# Altium schematic sheet CUBE3RX.SchDoc
size A3
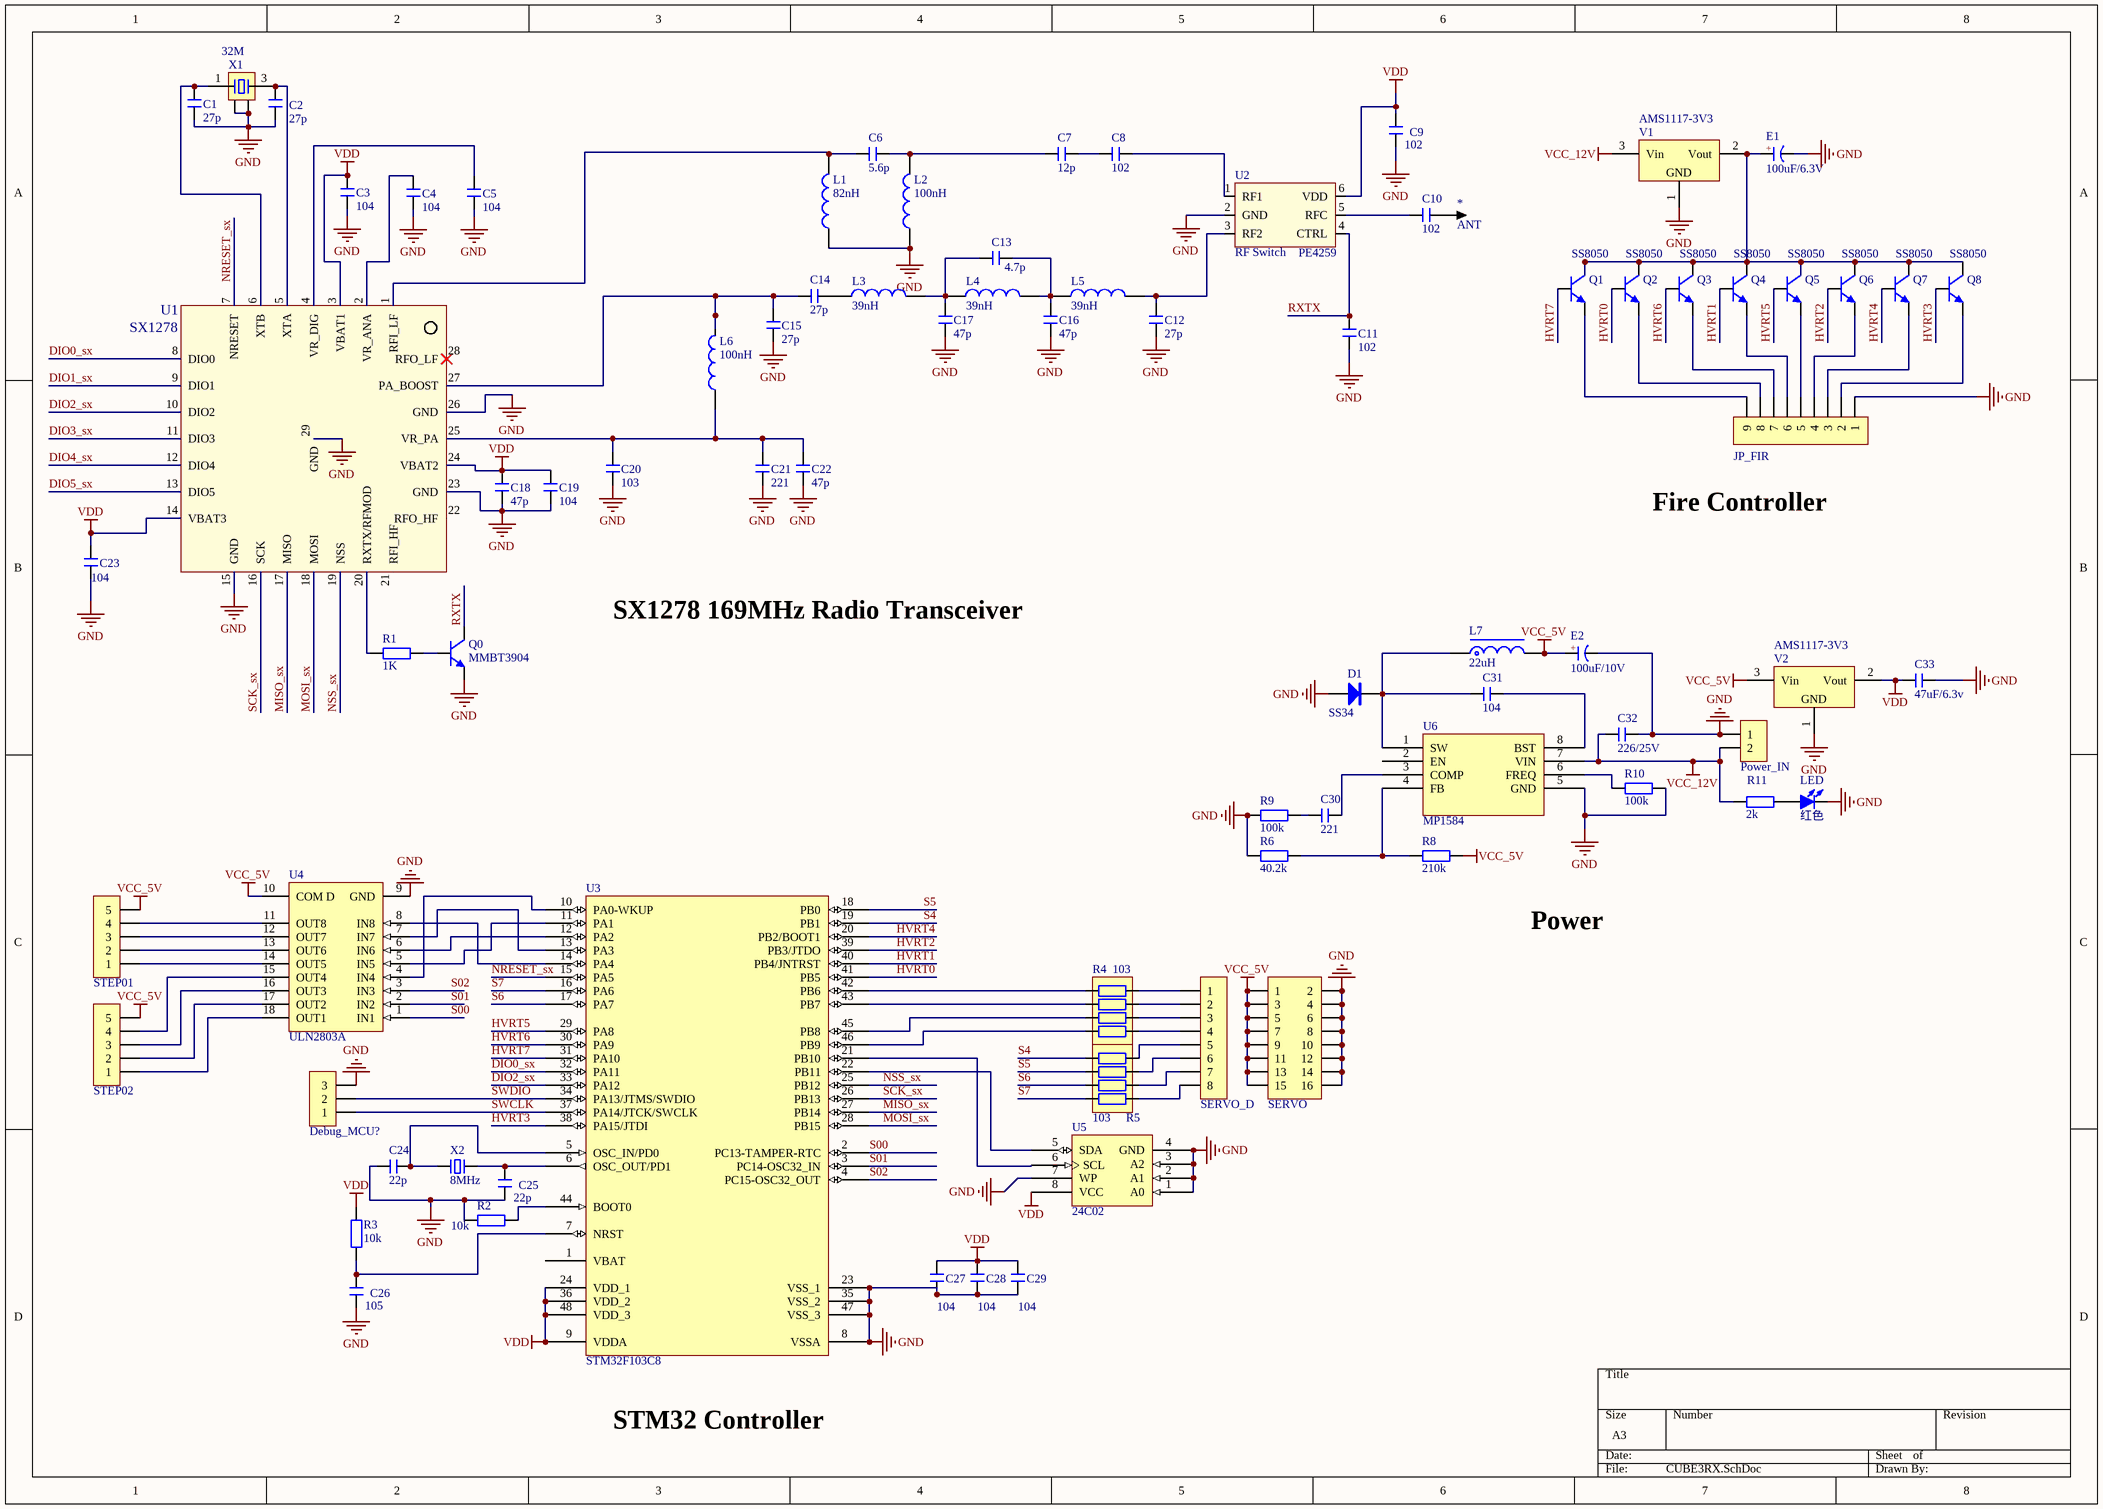
[diagram p0: CUBE3RX.SchDoc]

## Parts
*  ANT  [R100]
C1  27p  [C 0603_L]
C2  27p  [C 0603_L]
C3  104  [C 0603_L]
C4  104  [C 0603_L]
C5  104  [C 0603_L]
C6  5.6p  [C 0402_L]
C7  12p  [C 0402_L]
C8  102  [C 0402_L]
C9  102  [C 0402_L]
C10  102  [C 0402_L]
C11  102  [C 0402_L]
C12  27p  [C 0402_L]
C13  4.7p  [C 0402_L]
C14  27p  [C 0402_L]
C15  27p  [C 0402_L]
C16  47p  [C 0402_L]
C17  47p  [C 0402_L]
C18  47p  [C 0402_L]
C19  104  [C 0603_L]
C20  103  [C 0603_L]
C21  221  [C 0402_L]
C22  47p  [C 0402_L]
C23  104  [C 0603_L]
C24  22p  [C 0603_L]
C25  22p  [C 0603_L]
C26  105  [C 0603_L]
C27  104  [C 0603_L]
C28  104  [C 0603_L]
C29  104  [C 0603_L]
C30  221  [C 0603_L]
C31  104  [C 0603_L]
C32  226/25V  [C 1206_L]
C33  47uF/6.3v  [C 1206_L]
D1  SS34  [SMA]
Debug_MCU?  HDR-1X3  [HDR2.54-LI-3P]  (value not drawn)
E1  100uF/6.3V  [CM C(5*5.4)]
E2  100uF/10V  [CD B(3528)]
JP_FIR  HDR-1X9  [PH2.0-WS-9P]  (value not drawn)
L1  82nH  [L 0402]
L2  100nH  [L 0402]
L3  39nH  [L 0402]
L4  39nH  [L 0402]
L5  39nH  [L 0402]
L6  100nH  [L 0402]
L7  22uH  [NR4030]
LED  红色  [LED 0805G]
Power_IN  HDR-1X2  [XH2.54-LI-2P]  (value not drawn)
Q0  MMBT3904  [SOT23-3N]
Q1  SS8050  [SOT23-3N]
Q2  SS8050  [SOT23-3N]
Q3  SS8050  [SOT23-3N]
Q4  SS8050  [SOT23-3N]
Q5  SS8050  [SOT23-3N]
Q6  SS8050  [SOT23-3N]
Q7  SS8050  [SOT23-3N]
Q8  SS8050  [SOT23-3N]
R1  1K  [R 0603_L]
R2  10k  [R 0603_L]
R3  10k  [R 0603_L]
R4  103  [RCA-8P4R-0402]
R5  103  [RCA-8P4R-0402]
R6  40.2k  [R 0603_L]
R8  210k  [R 0603_L]
R9  100k  [R 0603_L]
R10  100k  [R 0603_L]
R11  2k  [R 0603_L]
SERVO  Header 8X2  [HDR2.54-LI-2x8P]  (value not drawn)
SERVO_D  HDR-1X8  [HDR2.54-LI-8P]  (value not drawn)
STEP01  HDR-1X5  [XH2.54-LI-5P]  (value not drawn)
STEP02  HDR-1X5  [XH2.54-LI-5P]  (value not drawn)
U1  SX1278  [vqfn28_6x6mm]
U2  RF Switch  value PE4259  [SC70-6]
U3  STM32F103C8  [LQFP48 7X7_M]
U4  ULN2803A  [SOP18W_N]
U5  24C02  [SOP8_L]
U6  MP1584  [SOP8_L]
V1  AMS1117-3V3  [SOT223_L]
V2  AMS1117-3V3  [SOT223_L]
X1  32M  [OSC 3225-4P]
X2  8MHz  [OSC 5032-2P]

## Nets
GND: C1.1 C2.1 C3.1 C4.1 C5.1 C9.1 C11.1 C12.1 C15.1 C16.1 C17.1 C18.1 C19.1 C20.1 C21.1 C22.1 C23.1 C24.1 C25.2 C26.2 C27.1 C28.1 C29.1 C32.2 C33.2 D1.1(A) Debug_MCU?.3 E1.2(K) E2.2(K) JP_FIR.1 L1.1 L2.1 LED.2(K) Power_IN.1 Q0.2(E) R2.2 R6.1 R9.1 R10.2 SERVO.2 SERVO.4 SERVO.6 SERVO.8 SERVO.10 SERVO.12 SERVO.14 SERVO.16 U1.15(GND) U1.23(GND) U1.26(GND) U1.29(GND) U2.2(GND) U3.8(VSSA) U3.23(VSS_1) U3.35(VSS_2) U3.47(VSS_3) U4.9(GND) U5.1(A0) U5.2(A1) U5.3(A2) U5.4(GND) U5.7(WP) U6.5(GND) V1.1(GND) V2.1(GND) X1.2 X1.4
VCC_5V: E2.1(A) L7.2 R8.2 SERVO.1 SERVO.3 SERVO.5 SERVO.7 SERVO.9 SERVO.11 SERVO.13 SERVO.15 STEP01.5 STEP02.5 U4.10(COM_D) V2.3(Vin)
VCC_12V: C32.1 Power_IN.2 R11.1 U6.7(VIN) V1.3(Vin)
VDD: C3.2 C9.2 C18.2 C19.2 C23.2 C27.2 C28.2 C29.2 C33.1 R3.2 U1.3(VBAT1) U1.14(VBAT3) U1.24(VBAT2) U2.6(VDD) U3.9(VDDA) U3.24(VDD_1) U3.36(VDD_2) U3.48(VDD_3) U5.8(VCC) V2.2(Vout)
DIO0_sx: U1.8(DIO0) U3.32(PA11)
DIO1_sx: U1.9(DIO1)
DIO2_sx: U1.10(DIO2) U3.33(PA12)
DIO3_sx: U1.11(DIO3)
DIO4_sx: U1.12(DIO4)
DIO5_sx: U1.13(DIO5)
HVRT0: Q2.1(B) U3.41(PB5)
HVRT1: Q4.1(B) U3.40(PB4/JNTRST)
HVRT2: Q6.1(B) U3.39(PB3/JTDO)
HVRT3: Q8.1(B) U3.38(PA15/JTDI)
HVRT4: Q7.1(B) U3.20(PB2/BOOT1)
HVRT5: Q5.1(B) U3.29(PA8)
HVRT6: Q3.1(B) U3.30(PA9)
HVRT7: Q1.1(B) U3.31(PA10)
MISO_sx: U1.17(MISO) U3.27(PB14)
MOSI_sx: U1.18(MOSI) U3.28(PB15)
NRESET_sx: U1.7(NRESET) U3.15(PA5)
NSS_sx: U1.19(NSS) U3.25(PB12)
RXTX: C11.2 Q0.3(C) U2.4(CTRL)
S00: U3.2(PC13-TAMPER-RTC) U4.1(IN1)
S01: U3.3(PC14-OSC32_IN) U4.2(IN2)
S02: U3.4(PC15-OSC32_OUT) U4.3(IN3)
S4: R5.1 U3.19(PB1)
S5: R5.2 U3.18(PB0)
S6: R5.3 U3.17(PA7)
S7: R5.4 U3.16(PA6)
SCK_sx: U1.16(SCK) U3.26(PB13)
SWCLK: Debug_MCU?.1 U3.37(PA14/JTCK/SWCLK)
SWDIO: Debug_MCU?.2 U3.34(PA13/JTMS/SWDIO)
Net*_1: *.1 C10.2
NetC1_2: C1.2 U1.6(XTB) X1.1
NetC2_2: C2.2 U1.5(XTA) X1.3
NetC4_2: C4.2 U1.2(VR_ANA)
NetC5_2: C5.2 U1.4(VR_DIG)
NetC6_1: C6.1 L1.2 U1.1(RFI_LF)
NetC6_2: C6.2 C7.1 L2.2
NetC7_2: C7.2 C8.1
NetC8_2: C8.2 U2.1(RF1)
NetC10_1: C10.1 U2.5(RFC)
NetC12_2: C12.2 L5.2 U2.3(RF2)
NetC13_1: C13.1 C16.2 L4.2 L5.1
NetC13_2: C13.2 C17.2 L3.2 L4.1
NetC14_1: C14.1 L3.1
NetC14_2: C14.2 C15.2 L6.2 U1.27(PA_BOOST)
NetC20_2: C20.2 C21.2 C22.2 L6.1 U1.25(VR_PA)
NetC24_2: C24.2 U3.5(OSC_IN/PD0) X2.2
NetC25_1: C25.1 U3.6(OSC_OUT/PD1) X2.1
NetC26_1: C26.1 R3.1 U3.7(NRST)
NetC30_1: C30.1 R9.2
NetC30_2: C30.2 U6.3(COMP)
NetC31_1: C31.1 D1.2(K) L7.1 U6.1(SW)
NetC31_2: C31.2 U6.8(BST)
NetE1_1: E1.1(A) Q1.3(C) Q2.3(C) Q3.3(C) Q4.3(C) Q5.3(C) Q6.3(C) Q7.3(C) Q8.3(C) V1.2(Vout)
NetJP_FIR_2: JP_FIR.2 Q8.2(E)
NetJP_FIR_3: JP_FIR.3 Q7.2(E)
NetJP_FIR_4: JP_FIR.4 Q6.2(E)
NetJP_FIR_5: JP_FIR.5 Q5.2(E)
NetJP_FIR_6: JP_FIR.6 Q4.2(E)
NetJP_FIR_7: JP_FIR.7 Q3.2(E)
NetJP_FIR_8: JP_FIR.8 Q2.2(E)
NetJP_FIR_9: JP_FIR.9 Q1.2(E)
NetLED_1: LED.1(A) R11.2
NetQ0_1: Q0.1(B) R1.2
NetR1_1: R1.1 U1.20(RXTX/RFMOD)
NetR2_1: R2.1 U3.44(BOOT0)
NetR4_1: R4.1 U3.42(PB6)
NetR4_2: R4.2 U3.43(PB7)
NetR4_3: R4.3 U3.45(PB8)
NetR4_4: R4.4 U3.46(PB9)
NetR4_5: R4.5 SERVO_D.4
NetR4_6: R4.6 SERVO_D.3
NetR4_7: R4.7 SERVO_D.2
NetR4_8: R4.8 SERVO_D.1
NetR5_5: R5.5 SERVO_D.8
NetR5_6: R5.6 SERVO_D.7
NetR5_7: R5.7 SERVO_D.6
NetR5_8: R5.8 SERVO_D.5
NetR6_2: R6.2 R8.1 U6.4(FB)
NetR10_1: R10.1 U6.6(FREQ)
NetSTEP01_1: STEP01.1 U4.14(OUT5)
NetSTEP01_2: STEP01.2 U4.13(OUT6)
NetSTEP01_3: STEP01.3 U4.12(OUT7)
NetSTEP01_4: STEP01.4 U4.11(OUT8)
NetSTEP02_1: STEP02.1 U4.18(OUT1)
NetSTEP02_2: STEP02.2 U4.17(OUT2)
NetSTEP02_3: STEP02.3 U4.16(OUT3)
NetSTEP02_4: STEP02.4 U4.15(OUT4)
NetU3_10: U3.10(PA0-WKUP) U4.4(IN4)
NetU3_11: U3.11(PA1) U4.5(IN5)
NetU3_12: U3.12(PA2) U4.6(IN6)
NetU3_13: U3.13(PA3) U4.7(IN7)
NetU3_14: U3.14(PA4) U4.8(IN8)
NetU3_21: U3.21(PB10) U5.6(SCL)
NetU3_22: U3.22(PB11) U5.5(SDA)

Not connected (* = marked no-connect by the designer): U1 21(RFI_HF) 22(RFO_HF) 28(RFO_LF)*; U3 1(VBAT); U6 2(EN)

## Notes on the sheet
- Fire Controller
- SX1278 169MHz Radio Transceiver
- Power
- STM32 Controller
- (in symbol C-CD) +
- (in symbol C-CM) +

## Library data of the parts
* = CS: 探针焊盘; 版权归属: 源创客; BOM名称: 探针焊盘; 学习资源: www.ooocke.com
C1-C33 = C: 无极性贴片电容; 版权归属: 源创客; BOM名称: 无极性贴片电容; 学习资源: www.ooocke.com
D1 = SS14: 肖特基二极管; 版权归属: 源创客; 属性: 40V/1A; BOM名称: 肖特基二极管; 学习资源: www.ooocke.com
Debug_MCU? = Header 3: 3P接插件; 版权归属: 源创客; BOM名称: 3P接插件; 学习资源: www.ooocke.com
E1 = C-CM: 贴片电解电容; 版权归属: 源创客; BOM名称: 贴片电解电容; 学习资源: www.ooocke.com
E2 = C-CD: 贴片钽电容; 版权归属: 源创客; BOM名称: 贴片钽电容; 学习资源: www.ooocke.com
JP_FIR = Header 9: 9P接插件; 版权归属: 源创客; BOM名称: 9P接插件; 学习资源: www.ooocke.com
L1-L6 = L: 小功率贴片电感; 版权归属: 源创客; BOM名称: 小功率贴片电感; 学习资源: www.ooocke.com
L7 = L-NR: NR磁胶电感; 版权归属: 源创客; BOM名称: NR磁胶电感; 学习资源: www.ooocke.com
LED = LED-SMD: 贴片LED; 版权归属: 源创客; BOM名称: 贴片LED; 学习资源: www.ooocke.com
Power_IN = Header 2: 2P接插件; 版权归属: 源创客; BOM名称: 2P接插件; 学习资源: www.ooocke.com
Q0-Q8 = 8050-SMD: 高频放大-NPN型; 版权归属: 源创客; 属性: 40V 1.5A 1W 100MHZ; BOM名称: 高频放大-NPN型; 学习资源: www.ooocke.com
R1-R3 R6 R8-R11 = R: 贴片电阻; 版权归属: 源创客; BOM名称: 贴片电阻; 学习资源: www.ooocke.com
R4 R5 = R-8P4R: 贴片网络排阻; 版权归属: 源创客; BOM名称: 贴片网络排阻; 学习资源: www.ooocke.com
SERVO = Header 8X2: 8*2P接插件; 版权归属: 源创客; BOM名称: 8*2P接插件; 学习资源: www.ooocke.com
SERVO_D = Header 8: 8P接插件; 版权归属: 源创客; BOM名称: 8P接插件; 学习资源: www.ooocke.com
STEP01 STEP02 = Header 5: 5P接插件; 版权归属: 源创客; BOM名称: 5P接插件; 学习资源: www.ooocke.com
U1 = SX1276: SX1276 - Low Power Integrated UHF Transceiver with loRa Modem; LatestRevisionDate: 27-Jul-2009 -  Semtech
U2 = PE4259 RF Switch: PE4259 Peregrine RF Switch; LatestRevisionDate: 03-Sep-2012 -  Semtech
U3 = STM32F103C8: Flaah:64/RAM:20/IO:36; BOM名称: 32位STM单片机; 版权归属: 源创客; 学习资源: www.ooocke.com
U4 = ULN2803A: Eight Darlington Array; Published: 8-Jun-2000; LatestRevisionDate: 17-Jul-2002; LatestRevisionNote: Re-released for DXP Platform.; DatasheetDocument: Sep-1997; PackageReference: DIP18; Publisher: Altium Limited
U5 = 24Cxx: 外置EEPROM; 版权归属: 源创客; BOM名称: 外置EEPROM; 学习资源: www.ooocke.com
V1 V2 = AMS1117: 三端稳压芯片; BOM名称: 稳压芯片; 版权归属: 源创客; 学习资源: www.ooocke.com
X1 = XTAL-4P: 4脚无源晶振; 版权归属: 源创客; BOM名称: 4脚无源晶振; 学习资源: www.ooocke.com
X2 = XTAL-2P: 2脚无源脚晶振; 版权归属: 源创客; BOM名称: 2脚无源脚晶振; 学习资源: www.ooocke.com